# EAGLE design Ex Adafruit I2C Adapter (EAGLE 7.2.0)
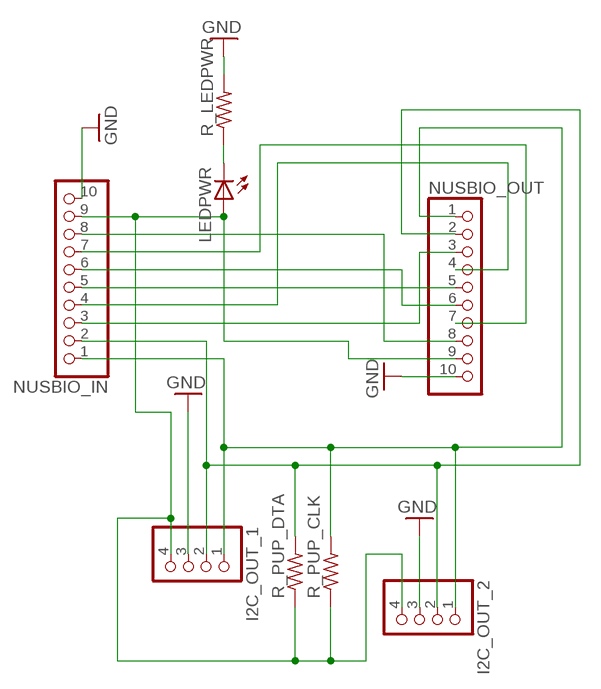
[diagram p0: schematic, sheet 1]

## Parts
I2C_OUT_1  PINHD-1X4  [1X04]
I2C_OUT_2  PINHD-1X4  [1X04]
LEDPWR  LEDCHIPLED_0805  [CHIPLED_0805]
NUSBIO_IN  PINHD-1X10  [1X10-BIG]
NUSBIO_OUT  PINHD-1X10  [1X10-BIG]
R_LEDPWR  R-US_R0805  [R0805]
R_PUP_CLK  R-US_R0805  [R0805]
R_PUP_DTA  R-US_R0805  [R0805]

## Nets
GND: I2C_OUT_1.3 I2C_OUT_2.3 NUSBIO_IN.10 NUSBIO_OUT.10 R_LEDPWR.2
N$1: LEDPWR.C R_LEDPWR.1
N$2: I2C_OUT_1.4 I2C_OUT_2.4 LEDPWR.A NUSBIO_IN.9 NUSBIO_OUT.9 R_PUP_CLK.1 R_PUP_DTA.1
N$3: NUSBIO_IN.6 NUSBIO_OUT.6
N$4: NUSBIO_IN.5 NUSBIO_OUT.5
N$5: NUSBIO_IN.3 NUSBIO_OUT.3
N$6: NUSBIO_IN.8 NUSBIO_OUT.8
N$7: NUSBIO_IN.4 NUSBIO_OUT.4
N$8: NUSBIO_IN.7 NUSBIO_OUT.7
N$9: I2C_OUT_1.1 I2C_OUT_2.1 NUSBIO_IN.1 NUSBIO_OUT.1 R_PUP_CLK.2
N$10: I2C_OUT_1.2 I2C_OUT_2.2 NUSBIO_IN.2 NUSBIO_OUT.2 R_PUP_DTA.2

## Library data of the parts
I2C_OUT_1 I2C_OUT_2 = pinhead:PINHD-1X4: PIN HEADER
LEDPWR = adafruit:LED: LED OSRAM: - CHIPLED LG R971, LG N971, LY N971, LG Q971, LY Q971, LO R971, LY R971 LH N974, LH R974 LS Q976, LO Q976, LY Q976 LO Q996 - Hyper CHIPLED LW Q18S LB Q993, LB Q99A, LB R99A - SideLED LS A670, LO A670, LY A670, LG A670, LP A670 LB A673, LV A673, LT A673, LW A673 LH A674 LY A675 LS A676, LA A676, LO A676, LY A676, LW A676 LS A679, LY A679, LG A679 - Hyper Micro SIDELED® LS Y876, LA Y876, LO Y876, LY Y876 LT Y87S - SmartLED LW L88C, LW L88S LB L89C, LB L89S, LG L890 LS L89K, LO L89K, LY L89K LS L896, LA L896, LO L896, LY L896 - TOPLED LS T670, LO T670, LY T670, LG T670, LP T670 LSG T670, LSP T670, LSY T670, LOP T670, LYG T670 LG T671, LOG T671, LSG T671 LB T673, LV T673, LT T673, LW T673 LH T674 LS T676, LA T676, LO T676, LY T676, LB T676, LH T676, LSB T676, LW T676 LB T67C, LV T67C, LT T67C, LS T67K, LO T67K, LY T67K, LW E67C LS E67B, LA E67B, LO E67B, LY E67B, LB E67C, LV E67C, LT E67C LW T67C LS T679, LY T679, LG T679 LS T770, LO T770, LY T770, LG T770, LP T770 LB T773, LV T773, LT T773, LW T773 LH T774 LS E675, LA E675, LY E675, LS T675 LS T776, LA T776, LO T776, LY T776, LB T776 LHGB T686 LT T68C, LB T68C - Hyper Mini TOPLED® LB M676 - Mini TOPLED Santana® LG M470 LS M47K, LO M47K, LY M47K Source: http://www.osram.convergy.de/
NUSBIO_IN NUSBIO_OUT = adafruit:PINHD-1X10: Pin header 1x10 0.1" spacing With round pins
R_LEDPWR R_PUP_CLK R_PUP_DTA = adafruit:R-US_: RESISTOR, American symbol

## Board
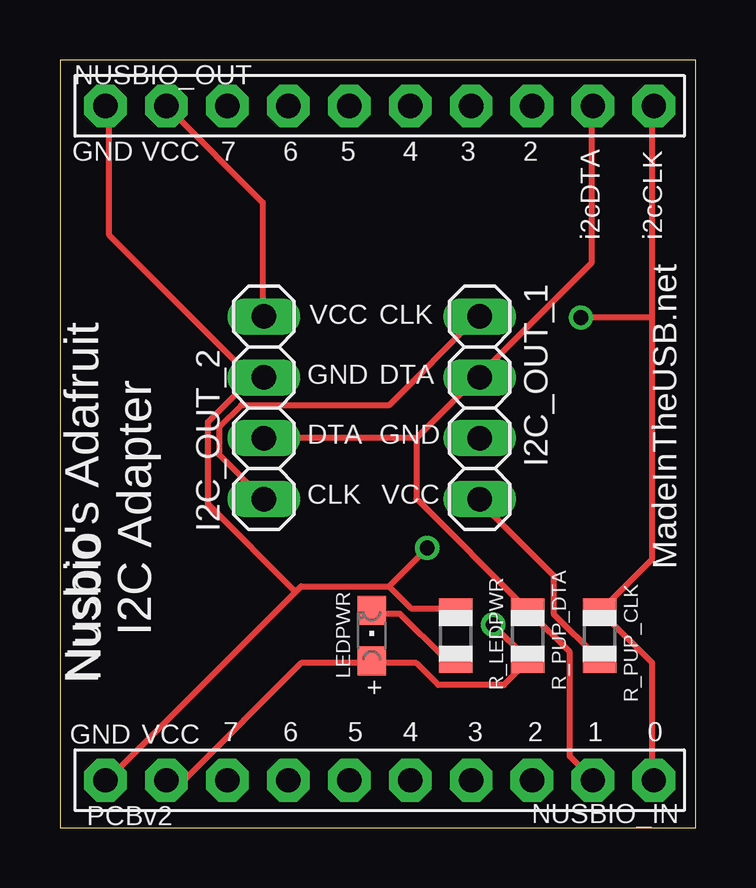
[diagram p1: board, top side]
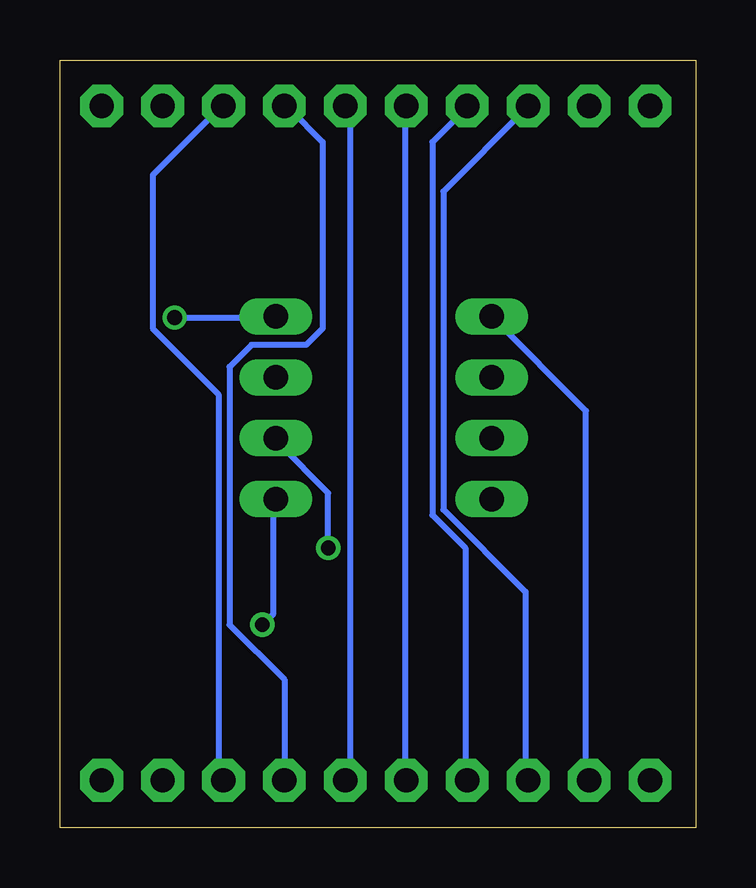
[diagram p2: board, bottom side, seen from below]

Size 26.5 x 32 mm. Coordinates in mm from the lower left corner, seen from the top.
Outline: 0,0 26.5,0 26.5,32 0,32 0,0
Copper layers (1*16): Top 0.035mm / dielectric 1.5mm / Bottom 0.035mm
Design rules "default": minimum track width 10mil, minimum drill 24mil, track to track 8mil, track to pad 8mil, pad to pad 8mil, via to via 8mil, smd to smd 8mil, copper to edge 40mil, drill to drill 8mil, minimum pad ring 10mil, minimum via ring 8mil, stop-mask expansion 4mil, vias tented up to drill 0mil, thermal gap 10mil

### Footprints (pad centres in the part's own frame; a part is rotated, then mirrored left to right if it is on the bottom)
1X04 = drill 1.016 long: 1 -3.81,0; 2 -1.27,0; 3 1.27,0; 4 3.81,0
CHIPLED_0805 = smd 1.2 x 1.2: A 0,-1.05; C 0,1.05
1X10-BIG = drill 1.016 pad 1.778 octagon: 1 -11.43,0; 2 -8.89,0; 3 -6.35,0; 4 -3.81,0; 5 -1.27,0; 6 1.27,0; 7 3.81,0; 8 6.35,0; 9 8.89,0; 10 11.43,0
R0805 = smd 1.1 x 1.4: 1 -1,0; 2 1,0

### Placement (x,y rotation side)
I2C_OUT_1  17.5,17.5 270 top
I2C_OUT_2  8.5,17.5 90 top
LEDPWR  13,8 0 top
NUSBIO_IN  13.33,1.97 180 top
NUSBIO_OUT  13.33,30.09 180 top
R_LEDPWR  16.5,8 90 top
R_PUP_CLK  22.5,8 90 top
R_PUP_DTA  19.5,8 90 top

### Tracks (layer width: path | path; a pad name or v marks a point on that pad's centre or on a via)
GND  (via drill 0.61)
  Top 0.254: 13.72,10.06 14.63,9.14 16.46,9.14 R_LEDPWR.2 | 13.72,10.06 10.06,10.06 9.83,9.83 | 9.83,9.83 2.06,2.06 NUSBIO_IN.10 | 13.72,10.06 v15.32,11.66 | 8,18.75 8.46,18.75 I2C_OUT_2.3 8,18.75 | 8,18.75 6.17,16.92 6.17,13.49 9.83,9.83 | 8,18.75 2.06,24.69 2.06,29.95 NUSBIO_OUT.10
  Bottom 0.254: v15.32,11.66 15.32,13.95 17.37,16 I2C_OUT_1.3
N$1
  Top 0.254: LEDPWR.C 13.03,8.91 14.17,8.91 16,7.09 16.46,7.09 R_LEDPWR.1
N$2  (via drill 0.61)
  Top 0.254: I2C_OUT_2.4 8.46,21.49 8.46,26.06 4.57,29.95 NUSBIO_OUT.9 | R_PUP_CLK.1 22.4,7.09 20.57,8.91 20.57,10.52 17.6,13.49 I2C_OUT_1.4 | NUSBIO_IN.9 4.57,2.06 5.26,2.06 10.06,6.86 12.8,6.86 LEDPWR.A 13.03,6.86 14.86,6.86 15.77,5.94 18.52,5.94 19.43,6.86 R_PUP_DTA.1 19.43,7.09 v18.06,8.46
  Bottom 0.254: v18.06,8.46 17.6,8.91 17.6,13.49 I2C_OUT_1.4 | I2C_OUT_2.4 8.46,21.26 4.57,17.37 4.57,2.06 NUSBIO_IN.9
N$3
  Bottom 0.254: NUSBIO_IN.6 12.12,2.06 12.12,29.95 NUSBIO_OUT.6
N$4
  Bottom 0.254: NUSBIO_IN.5 14.4,2.06 14.4,29.95 NUSBIO_OUT.5
N$5
  Bottom 0.254: NUSBIO_IN.3 19.89,2.06 19.89,18.06 22.63,20.8 22.63,27.2 19.89,29.95 NUSBIO_OUT.3
N$6
  Bottom 0.254: NUSBIO_IN.8 7.09,2.06 7.09,9.83 10.52,13.26 10.52,26.52 7.09,29.95 NUSBIO_OUT.8
N$7
  Bottom 0.254: NUSBIO_IN.4 17.14,2.06 17.14,6.17 19.43,8.46 19.43,19.2 18.52,20.12 16.23,20.12 15.54,20.8 15.54,28.57 16.92,29.95 NUSBIO_OUT.4
N$8
  Bottom 0.254: NUSBIO_IN.7 9.6,2.06 9.6,11.66 10.97,13.03 10.97,28.57 9.6,29.95 NUSBIO_OUT.7
N$9  (via drill 0.61)
  Top 0.254: I2C_OUT_2.1 8.46,13.72 6.63,15.54 6.63,16.69 7.54,17.6 13.72,17.6 17.37,21.26 I2C_OUT_1.1 | NUSBIO_IN.1 24.69,2.06 24.69,6.86 22.63,8.91 R_PUP_CLK.2 22.63,9.14 24.69,11.2 24.69,21.26 | 24.69,21.26 24.69,29.95 NUSBIO_OUT.1 | 24.69,21.26 v21.72,21.26
  Bottom 0.254: v21.72,21.26 17.6,21.26 I2C_OUT_1.1
N$10
  Top 0.254: NUSBIO_IN.2 22.17,2.06 21.26,2.97 21.26,7.32 19.66,8.91 R_PUP_DTA.2 19.43,9.14 14.86,13.72 14.86,16.23 | 14.86,16.23 8.69,16.23 I2C_OUT_2.2 | 14.86,16.23 17.37,18.75 I2C_OUT_1.2 17.6,18.97 22.17,23.55 22.17,29.95 NUSBIO_OUT.2

### Text on the board
tNames: GND | VCC | 7 | 6 | 5 | 4 | 3 | 2 | i2cDTA | MadeInTheUSB.net | i2cCLK | VCC | CLK | GND | DTA | DTA | GND | CLK | VCC | I2C Adapter | Nusbio's Adafruit | Nusbio | + | GND | VCC | 7 | 6 | 5 | 4 | 3 | 2 | 1 | 0 | PCBv2